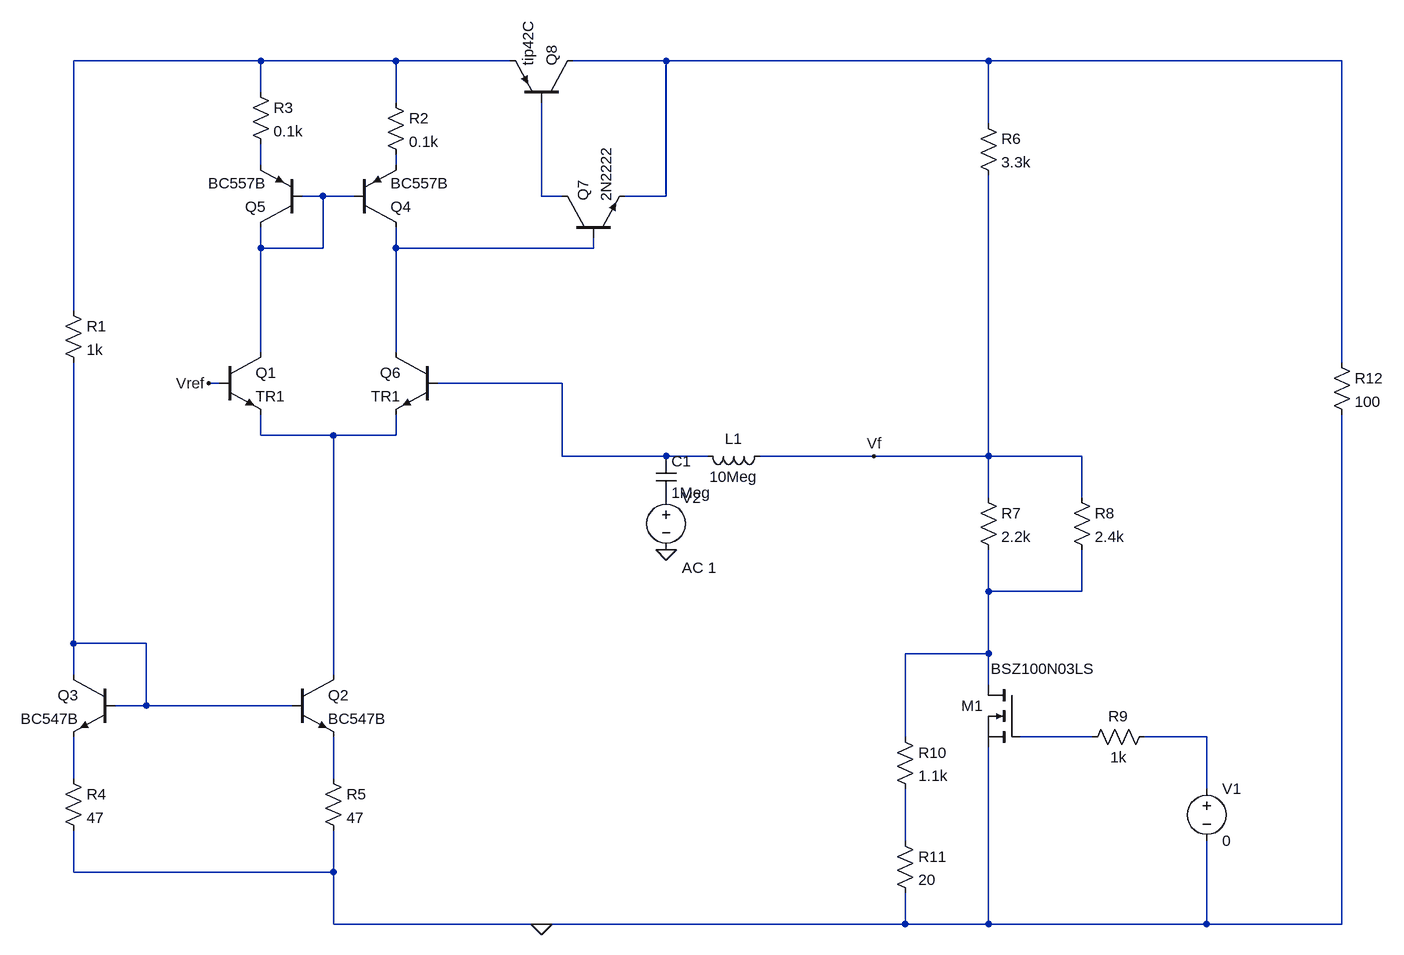
[diagram p0: schematic ganancia_de_lazo_B.asc]
ganancia_de_lazo_B.asc, the LTspice schematic file:
Version 4
SHEET 1 2040 884
WIRE 192 -464 -96 -464
WIRE 400 -464 192 -464
WIRE 576 -464 400 -464
WIRE 816 -464 672 -464
WIRE 1312 -464 816 -464
WIRE 1856 -464 1312 -464
WIRE 192 -416 192 -464
WIRE 400 -400 400 -464
WIRE 1312 -368 1312 -464
WIRE 192 -304 192 -336
WIRE 400 -304 400 -320
WIRE 288 -256 256 -256
WIRE 336 -256 288 -256
WIRE 624 -256 624 -400
WIRE 656 -256 624 -256
WIRE 816 -256 816 -464
WIRE 816 -256 752 -256
WIRE 192 -176 192 -208
WIRE 288 -176 288 -256
WIRE 288 -176 192 -176
WIRE 400 -176 400 -208
WIRE 704 -176 704 -192
WIRE 704 -176 400 -176
WIRE -96 -80 -96 -464
WIRE 192 -16 192 -176
WIRE 400 -16 400 -176
WIRE 1856 0 1856 -464
WIRE 128 32 112 32
WIRE 656 32 464 32
WIRE 192 112 192 80
WIRE 304 112 192 112
WIRE 400 112 400 80
WIRE 400 112 304 112
WIRE 656 144 656 32
WIRE 816 144 656 144
WIRE 880 144 816 144
WIRE 1136 144 960 144
WIRE 1312 144 1312 -288
WIRE 1312 144 1136 144
WIRE 1456 144 1312 144
WIRE 1312 208 1312 144
WIRE 1456 208 1456 144
WIRE 1312 352 1312 288
WIRE 1456 352 1456 288
WIRE 1456 352 1312 352
WIRE -96 432 -96 0
WIRE 16 432 -96 432
WIRE 1312 448 1312 352
WIRE 1312 448 1184 448
WIRE -96 480 -96 432
WIRE 304 480 304 112
WIRE 1312 496 1312 448
WIRE 16 528 16 432
WIRE 16 528 -32 528
WIRE 240 528 16 528
WIRE 1184 576 1184 448
WIRE 1472 576 1360 576
WIRE 1648 576 1552 576
WIRE -96 640 -96 576
WIRE 304 640 304 576
WIRE 1648 656 1648 576
WIRE 1184 736 1184 656
WIRE -96 784 -96 720
WIRE 304 784 304 720
WIRE 304 784 -96 784
WIRE 304 864 304 784
WIRE 624 864 304 864
WIRE 1184 864 1184 816
WIRE 1184 864 624 864
WIRE 1312 864 1312 592
WIRE 1312 864 1184 864
WIRE 1648 864 1648 736
WIRE 1648 864 1312 864
WIRE 1856 864 1856 80
WIRE 1856 864 1648 864
FLAG 112 32 Vref
FLAG 1136 144 Vf
FLAG 624 864 0
FLAG 816 288 0
DATAFLAG 112 32 ""
DATAFLAG 400 -144 ""
DATAFLAG 192 -96 ""
SYMBOL npn 128 -16 R0
SYMATTR InstName Q1
SYMATTR Value TR1
SYMBOL npn 240 480 R0
SYMATTR InstName Q2
SYMATTR Value BC547B
SYMBOL npn -32 480 M0
SYMATTR InstName Q3
SYMATTR Value BC547B
SYMBOL res -112 -96 R0
SYMATTR InstName R1
SYMATTR Value 1k
SYMBOL res 384 -416 R0
SYMATTR InstName R2
SYMATTR Value 0.1k
SYMBOL res 176 -432 R0
SYMATTR InstName R3
SYMATTR Value 0.1k
SYMBOL pnp 336 -208 M180
SYMATTR InstName Q4
SYMATTR Value BC557B
SYMBOL pnp 256 -208 R180
SYMATTR InstName Q5
SYMATTR Value BC557B
SYMBOL npn 464 -16 M0
SYMATTR InstName Q6
SYMATTR Value TR1
SYMBOL res -112 624 R0
SYMATTR InstName R4
SYMATTR Value 47
SYMBOL res 288 624 R0
SYMATTR InstName R5
SYMATTR Value 47
SYMBOL res 1296 -384 R0
SYMATTR InstName R6
SYMATTR Value 3.3k
SYMBOL res 1296 192 R0
SYMATTR InstName R7
SYMATTR Value 2.2k
SYMBOL res 1440 192 R0
SYMATTR InstName R8
SYMATTR Value 2.4k
SYMBOL nmos 1360 496 M0
WINDOW 3 -116 -25 Left 2
SYMATTR Value BSZ100N03LS
SYMATTR InstName M1
SYMBOL res 1568 560 R90
WINDOW 0 0 56 VBottom 2
WINDOW 3 32 56 VTop 2
SYMATTR InstName R9
SYMATTR Value 1k
SYMBOL voltage 1648 640 R0
WINDOW 123 0 0 Left 0
WINDOW 39 0 0 Left 0
SYMATTR InstName V1
SYMATTR Value 0
SYMBOL res 1168 560 R0
SYMATTR InstName R10
SYMATTR Value 1.1k
SYMBOL res 1168 720 R0
SYMATTR InstName R11
SYMATTR Value 20
SYMBOL npn 656 -192 R270
SYMATTR InstName Q7
SYMATTR Value 2N2222
SYMBOL pnp 672 -400 M270
SYMATTR InstName Q8
SYMATTR Value tip42C
SYMBOL res 1840 -16 R0
SYMATTR InstName R12
SYMATTR Value 100
SYMBOL ind 976 128 R90
WINDOW 0 5 56 VBottom 2
WINDOW 3 32 56 VTop 2
SYMATTR InstName L1
SYMATTR Value 10Meg
SYMBOL cap 800 144 R0
SYMATTR InstName C1
SYMATTR Value 1Meg
SYMBOL voltage 816 192 R0
WINDOW 123 24 124 Left 2
WINDOW 39 0 0 Left 0
SYMATTR InstName V2
SYMATTR Value ""
SYMATTR Value2 AC 1

The netlist it stands for:
* ganancia_de_lazo_B.asc
Q1 N005 Vref N009 0 TR1
Q2 N009 N011 N015 0 BC547B
Q3 N011 N011 N014 0 BC547B
R1 N001 N011 1k
R2 N001 N004 0.1k
R3 N001 N003 0.1k
Q4 N007 N005 N004 0 BC557B
Q5 N005 N005 N003 0 BC557B
Q6 N007 N008 N009 0 TR1
R4 N014 0 47
R5 N015 0 47
R6 N002 Vf 3.3k
R7 Vf N010 2.2k
R8 Vf N010 2.4k
M1 N010 N012 0 0 BSZ100N03LS
R9 N013 N012 1k
V1 N013 0 0
R10 N010 N016 1.1k
R11 N016 0 20
Q7 N006 N007 N002 0 2N2222
Q8 N002 N006 N001 0 tip42C
R12 N002 0 100
L1 Vf N008 10Meg
C1 N008 P001 1Meg
V2 P001 0 AC 1
.model NPN NPN
.model PNP PNP
.lib standard.bjt
.model NMOS NMOS
.model PMOS PMOS
.lib standard.mos
.backanno
.end